# EAGLE board apex2_1 (EAGLE 5.09)
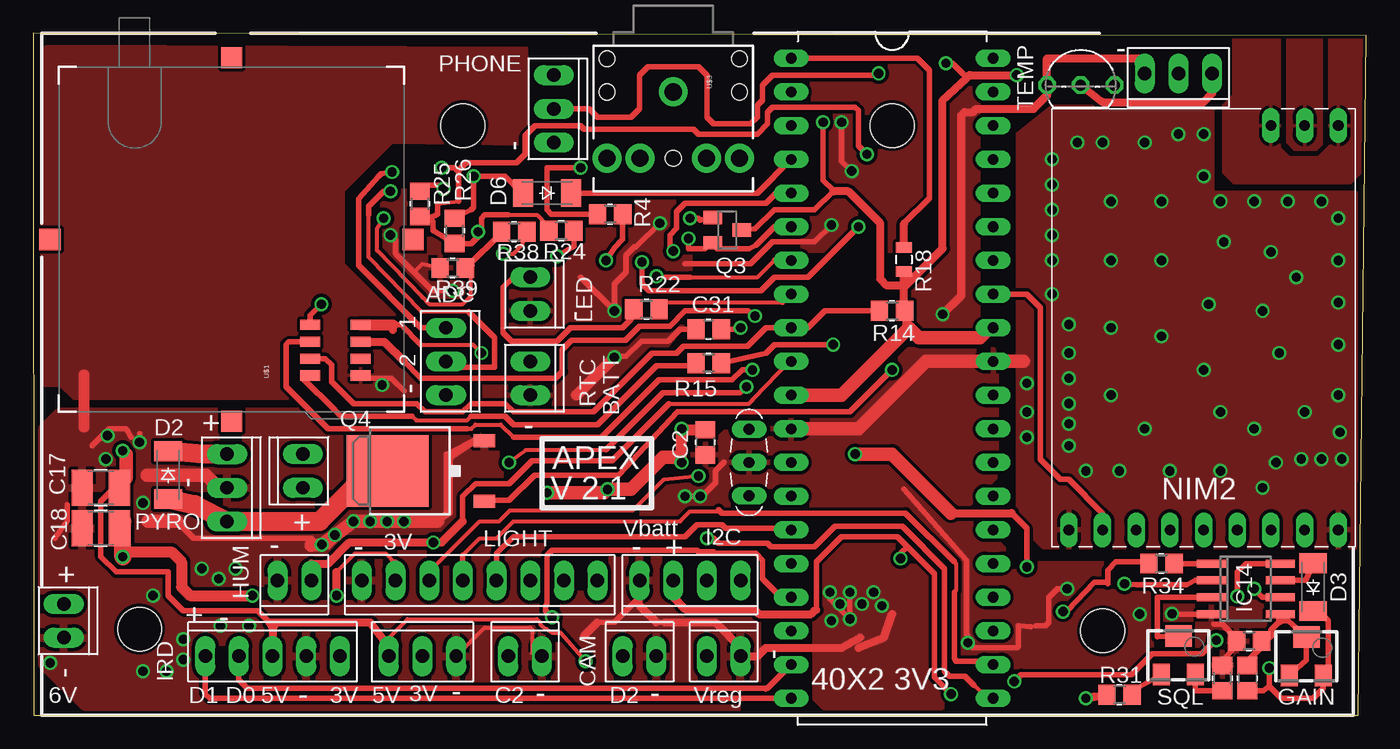
[diagram p1: board, top side]
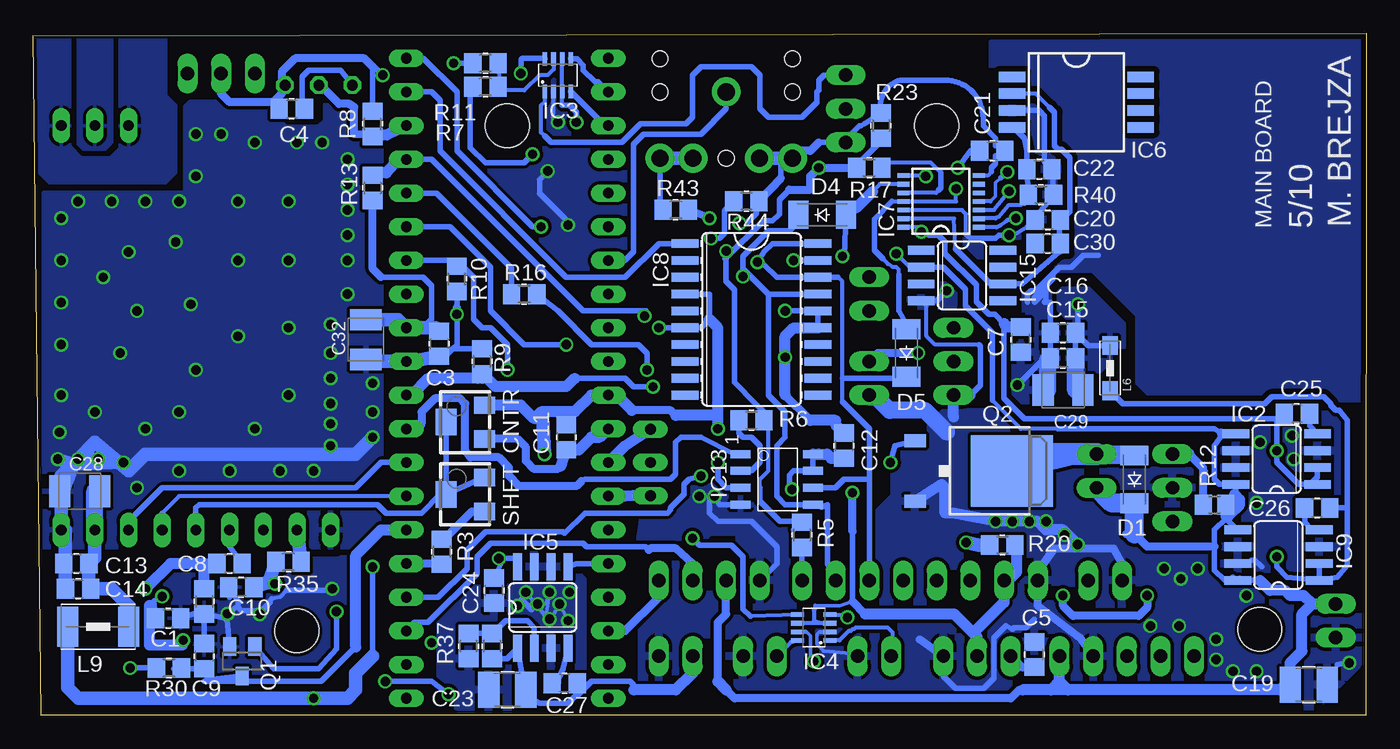
[diagram p2: board, bottom side, seen from below]

Size 100.57 x 51.45 mm. Coordinates in mm from the lower left corner, seen from the top.
Outline: 0.03,0.02 99.95,0 100.57,51.24 0,51.45 0.03,0.02
Copper layers (1*16): Top 0.035mm / dielectric 1.5mm / Bottom 0.035mm
Design rules "Fusion_eagle_rule_v1.1 *": minimum track width 6mil, minimum drill 12mil, track to track 10mil, track to pad 10mil, pad to pad 10mil, via to via 10mil, smd to smd 0mil, copper to edge 10mil, drill to drill 10mil, minimum pad ring 10mil, minimum via ring 6mil, stop-mask expansion 2mil, vias tented up to drill 100mil, thermal gap 10mil
Holes 3.3 mm at 32.41,44.47 64.8,44.47 80.67,6.37 8.03,6.5

## Footprints (pad centres in the part's own frame; a part is rotated, then mirrored left to right if it is on the bottom)
C0805 = smd 1.3 x 1.5: 1 -0.95,0; 2 0.95,0
C1210 = smd 1.6 x 2.7: 1 -1.4,0; 2 1.4,0
SMC_B = smd 1.6 x 2.4: + -1.5,0; - 1.5,0
SOD-123_MINI-SMA = smd 1.5 x 2.1: A 1.8,0; C -1.8,0
TO92- = drill 0.813 octagon: 1 -2.54,0; 2 0,0; 3 2.54,0
SO08 = smd 0.66 x 2.032: 1 -1.905,-3.073; 2 -0.635,-3.073; 3 0.635,-3.073; 4 1.905,-3.073; 5 1.905,3.073; 6 0.635,3.073; 7 -0.635,3.073; 8 -1.905,3.073
SOT23-8L = smd 0.35 x 1: 1 -0.975,-1.225; 2 -0.325,-1.225; 3 0.325,-1.225; 4 0.975,-1.225; 5 0.975,1.225; 6 0.325,1.225; 7 -0.325,1.225; 8 -0.975,1.225
SO8-7_5 = smd 0.8 x 2: 1 -1.905,-4.845; 2 -0.635,-4.845; 3 0.635,-4.845; 4 1.905,-4.845; 5 1.905,4.845; 6 0.635,4.845; 7 -0.635,4.845; 8 -1.905,4.845
TSSOP14 = smd 0.9 x 0.35: 1 -2.875,1.95; 2 -2.875,1.3; 3 -2.875,0.65; 4 -2.875,0; 5 -2.875,-0.65; 6 -2.875,-1.3; 7 -2.875,-1.95; 8 2.825,-1.95; 9 2.825,-1.3; 10 2.825,-0.65; 11 2.825,0; 12 2.825,0.65; 13 2.825,1.3; 14 2.825,1.95
SO20W = smd 0.66 x 2.032: 1 -5.715,-5.029; 2 -4.445,-5.029; 3 -3.175,-5.029; 4 -1.905,-5.029; 5 -0.635,-5.029; 6 0.635,-5.029; 7 1.905,-5.029; 8 3.175,-5.029; 9 4.445,-5.029; 10 5.715,-5.029; 11 5.715,5.029; 12 4.445,5.029; 13 3.175,5.029; 14 1.905,5.029; 15 0.635,5.029; 16 -0.635,5.029; 17 -1.905,5.029; 18 -3.175,5.029; 19 -4.445,5.029; 20 -5.715,5.029
SO8 = smd 0.61 x 1.524: 1 -1.27,-2.743; 2 0,-2.743; 3 1.27,-2.743; 4 2.54,-2.743; 5 2.54,2.743; 6 1.27,2.743; 7 0,2.743; 8 -1.27,2.743
SO08' = smd 0.6 x 2.2: 1 -1.905,-2.6; 2 -0.635,-2.6; 3 0.635,-2.6; 4 1.905,-2.6; 5 1.905,2.6; 6 0.635,2.6; 7 -0.635,2.6; 8 -1.905,2.6
10X08MTA = drill 1.016 long: 1 8.89,0; 2 6.35,0; 3 3.81,0; 4 1.27,0; 5 -1.27,0; 6 -3.81,0; 7 -6.35,0; 8 -8.89,0
10X05MTA = drill 1.016 long: 1 5.08,0; 2 2.54,0; 3 0,0; 4 -2.54,0; 5 -5.08,0
10X03MTA = drill 1.016 long: 1 2.54,0; 2 0,0; 3 -2.54,0
10X02MTA = drill 1.016 long: 1 1.27,0; 2 -1.27,0
10X04MTA = drill 1.016 long: 1 3.81,0; 2 1.27,0; 3 -1.27,0; 4 -3.81,0
1210 = smd 1.4 x 1.2: 1 -1.7,0; 2 1.7,0
1812 = smd 1.6 x 3: 1 -2.3,0; 2 2.3,0
DIL40 = drill 0.8 long: 1 -21.59,-8.89; 2 -19.05,-8.89; 3 -16.51,-8.89; 4 -13.97,-8.89; 5 -11.43,-8.89; 6 -8.89,-8.89; 7 -6.35,-8.89; 8 -3.81,-8.89; 9 -1.27,-8.89; 10 1.27,-8.89; 11 3.81,-8.89; 12 6.35,-8.89; 13 8.89,-8.89; 14 11.43,-8.89; 15 13.97,-8.89; 16 16.51,-8.89; 17 19.05,-8.89; 18 21.59,-8.89; 19 24.13,-8.89; 20 26.67,-8.89; 21 26.67,6.35; 22 24.13,6.35; 23 21.59,6.35; 24 19.05,6.35; 25 16.51,6.35; 26 13.97,6.35; 27 11.43,6.35; 28 8.89,6.35; 29 6.35,6.35; 30 3.81,6.35; 31 1.27,6.35; 32 -1.27,6.35; 33 -3.81,6.35; 34 -6.35,6.35; 35 -8.89,6.35; 36 -11.43,6.35; 37 -13.97,6.35; 38 -16.51,6.35; 39 -19.05,6.35; 40 -21.59,6.35
SOT23 = smd 1 x 1.4: 1 -0.95,-1.1; 2 0.95,-1.1; 3 0,1.1
DPACK_1 = smd 1 x 1.6: B -2.28,-4.8; E 2.28,-4.8 | smd 5.4 x 6.2: C 0,2.5
RTRIM3214W = smd 1.3 x 1.6: 1 -1.275,-1.45; 3 1.275,-1.45 | smd 2 x 1.6: 2 0,1.45
R0805 = smd 1.3 x 1.5: 1 -0.95,0; 2 0.95,0
R0805' = smd 1.3 x 1.5: 1 -0.85,0; 2 0.85,0
0805 = smd 0.8 x 1.2: 1 -0.9,0; 2 0.9,0
LASSEN_IQ_GPS = smd 0.762 x 1.524: 1 2.752,7.076; 2 2.752,3.266; 3 4.022,7.076; 4 4.022,3.266; 5 5.292,7.076; 6 5.292,3.266; 7 6.562,7.076; 8 6.562,3.266 | smd 1.6 x 1.6: GND1 -0.7,13; GND2 13,26.7; GND3 26.7,13; GND4 13,-0.7
CSTLS_G8 = drill 0.813 long: 1 -2.5,0; 2 0,0; 3 2.5,0
AUDIO-JACK = drill 1.3 pad 2.184 round: 1 0,0; 2 5,5; 3 5,2.5; 4 5,-2.5; 5 5,-5 | hole 1.2: 0,5; -2.5,5; -2.5,-5; 0,-5; 5,0
NIM2PK = drill 0.8 long: 1 -15.24,5.08; 2 -15.24,2.54; 3 -15.24,0; 10 15.24,-15.24; 11 15.24,-12.7; 12 15.24,-10.16; 13 15.24,-7.62; 14 15.24,-5.08; 15 15.24,-2.54; 16 15.24,0; 17 15.24,2.54; 18 15.24,5.08

## Placement (x,y rotation side)
C1  100n  [C0805]  90.39,7.32 180 bottom
C2  100n  [C0805]  50.7,20.6 90 top
C3  100n  [C0805]  69.94,28.03 90 bottom
C4  100n  [C0805]  81.05,45.74 180 bottom
C5  100n  [C0805]  25.05,4.59 270 bottom
C6  47n  [C0805]  91.59,2.82 270 top
C7  100n  [C0805]  26.06,28.34 90 bottom
C8  47n  [C0805]  85.75,11.45 0 bottom
C9  47n  [C0805]  87.66,4.47 270 bottom
C10  47n  [C0805]  84.86,9.67 0 bottom
C11  100n  [C0805]  60.35,20.98 90 bottom
C12  100n  [C0805]  39.4,20.34 270 bottom
C13  100n  [C0805]  97.31,11.45 0 bottom
C14  100p  [C0805]  97.18,9.55 0 bottom
C15  100n  [C0805]  22.89,26.95 0 bottom
C16  100p  [C0805]  22.89,28.85 0 bottom
C17  [C1210]  5.11,17.17 180 top
C18  22u  [C1210]  5.11,14.12 180 top
C19  [C1210]  4.35,2.31 0 bottom
C20  [C0805]  24.03,37.36 180 bottom
C21  [C0805]  28.22,42.57 0 bottom
C22  47p  [C0805]  24.67,41.17 0 bottom
C23  22u  [C1210]  64.8,1.93 180 bottom
C24  1u  [C0805]  65.81,9.42 90 bottom
C25  10n  [C0805]  5.23,22.75 0 bottom
C26  10n  [C0805]  3.71,15.64 180 bottom
C27  10n  [C0805]  60.48,2.43 180 bottom
C28  [SMC_B]  97.06,16.91 180 bottom
C29  [SMC_B]  22.89,24.53 180 bottom
C30  10n  [C0805]  24.03,35.58 0 bottom
C31  100n  [C0805]  50.95,29.1 0 top
C32  [SMC_B]  75.47,28.34 270 bottom
D1  CGRM4002-G  [SOD-123_MINI-SMA]  17.49,17.8 90 bottom
D2  CGRM4002-G  [SOD-123_MINI-SMA]  10.19,18.12 270 top
D3  CGRM4002-G  [SOD-123_MINI-SMA]  96.55,9.67 90 top
D4  CGRM4002-G  [SOD-123_MINI-SMA]  41.05,37.74 0 bottom
D5  CGRM4002-G  [SOD-123_MINI-SMA]  34.7,27.33 90 bottom
D6  CGRM4002-G  [SOD-123_MINI-SMA]  38.76,39.39 180 top
IC1  DS18B20  [TO92-]  79.02,47.52 0 top
IC2  LT1763  [SO08]  6.76,19.33 90 bottom
IC3  MAX3373E  [SOT23-8L]  60.99,48.28 0 bottom
IC4  MAX3373E  [SOT23-8L]  41.68,6.63 90 bottom
IC5  LT1763  [SO08]  62.13,8.15 0 bottom
IC6  MPX6115  [SO8-7_5]  21.87,46.25 270 bottom
IC7  MCP3204  [TSSOP14]  32.09,38.76 180 bottom
IC8  DS3234  [SO20W]  46.38,29.87 270 bottom
IC9  LT1763  [SO08]  6.63,12.09 90 bottom
IC13  FM25-S  [SO8]  44.48,18.44 270 bottom
IC14  CA3240ED  [SO08']  91.47,9.55 270 top
IC15  MAX6133  [SO08]  30.51,33.17 270 bottom
J1  [10X08MTA]  33.68,10.18 180 top
J2  [10X05MTA]  18.06,4.47 0 top
J3  [10X03MTA]  86.39,48.41 180 top
J4  [10X03MTA]  14.63,17.17 270 top
J5  [10X02MTA]  20.35,18.44 90 top
J6  [10X02MTA]  37.49,25.42 270 top
J7  [10X03MTA]  39.27,45.74 270 top
J8  [10X02MTA]  45.75,4.47 0 top
J9  [10X02MTA]  37.11,4.47 0 top
J10  [10X02MTA]  37.49,31.77 270 top
J11  [10X02MTA]  52.1,4.47 0 top
J12  [10X02MTA]  19.71,10.18 180 top
J13  [10X02MTA]  2.31,7.13 270 top
J14  [10X03MTA]  29.36,4.47 0 top
J15  [10X04MTA]  49.56,10.18 180 top
J18  [10X03MTA]  31.14,26.69 270 top
L6  [1210]  19.33,26.18 90 bottom
L9  [1812]  95.66,6.69 180 bottom
PIC1  PICAXE40X2  [DIL40]  66.07,27.96 270 top
Q1  BCX70SMD  [SOT23]  84.8,4.09 180 bottom
Q2  IRF740DPACK  [DPACK_1]  29.24,18.44 270 bottom
Q3  BCX70SMD  [SOT23]  52.35,36.6 270 top
Q4  IRF740DPACK  [DPACK_1]  29.24,18.44 90 top
R1  100K  [RTRIM3214W]  67.97,22.12 90 bottom
R2  100K  [RTRIM3214W]  67.97,16.66 90 bottom
R3  10K  [R0805]  69.75,12.34 270 bottom
R4  100  [R0805]  43.52,37.8 0 top
R5  100  [R0805]  42.57,13.61 270 bottom
R6  100  [R0805]  46.38,22.25 0 bottom
R7  0  [R0805]  66.45,47.39 180 bottom
R8  4k7  [R0805]  74.96,44.6 90 bottom
R9  100k  [R0805]  66.7,26.69 270 bottom
R10  100k  [R0805]  68.61,32.91 90 bottom
R11  0  [R0805]  66.45,49.17 180 bottom
R12  1k  [R0805']  11.46,15.9 0 bottom
R13  100k  [R0805]  74.96,39.77 270 bottom
R14  100k  [R0805]  64.8,30.5 0 top
R15  1k  [R0805]  50.95,26.56 180 top
R16  1k  [R0805]  63.53,31.77 0 bottom
R17  51k  [R0805]  37.49,41.3 0 bottom
R18  10K  [0805]  65.69,34.38 270 top
R20  22K  [R0805]  27.46,12.85 0 bottom
R22  1k  [R0805]  46.26,30.63 0 top
R23  33k  [R0805]  36.6,44.47 270 bottom
R24  10k  [R0805]  39.84,36.53 180 top
R25  10k  [R0805]  29.17,38.57 270 top
R26  10k  [R0805]  31.78,36.53 270 top
R27  100K  [RTRIM3214W]  96.04,4.47 0 top
R28  1K5  [R0805]  87.66,8.59 270 bottom
R29  1K  [R0805]  91.72,5.61 180 top
R30  10K  [R0805]  90.32,3.58 180 bottom
R31  10K  [R0805]  81.94,1.55 180 top
R32  10K  [R0805]  89.69,2.82 270 top
R33  100K  [RTRIM3214W]  86.39,4.53 0 top
R34  4K7  [R0805]  85.12,11.45 0 top
R35  10K  [R0805]  81.31,11.58 180 bottom
R36  22K  [R0805]  65.94,5.23 270 bottom
R37  22K  [R0805]  67.72,5.23 90 bottom
R38  4K7  [R0805]  36.29,36.47 0 top
R39  4K7  [R0805]  31.65,33.74 0 top
R40  51K  [R0805]  24.54,39.27 0 bottom
R43  10K  [R0805]  52.1,38.12 180 bottom
R44  10K  [R0805]  46.76,38.76 180 bottom
U$1  LASSEN_IQ_GPSLASSEN  [LASSEN_IQ_GPS]  27.97,22.88 90 top
U$2  RESONATOR_4M  [CSTLS_G8]  54,19.07 270 top
U$3  AUDIO-JACK2  [AUDIO-JACK]  48.29,47.01 270 top
X1  NIM2  [NIM2PK]  93.37,29.23 270 top

## Tracks (layer width: path | path; a pad name or v marks a point on that pad's centre or on a via)
1WIRE
  Top 0.61: J3.3 88.93,46.88 88.29,46.25 80.67,46.25 IC1.2
  Bottom 0.61: IC1.2 78.89,47.52 77.5,46.12 76.74,46.12 76.35,45.87 76.35,43.84 75.27,43.78 R8.1
  Bottom 0.813: R8.1 73.88,43.78 PIC1.38
+3V3  (via drill 0.7)
  Top 0.305: 22.89,10.82 24.28,12.21 26.57,12.21 27.33,11.45
  Top 0.406: Q3.3 54.47,36.68 55.91,38.12 58.96,38.12 60.35,39.52 60.35,39.58 59.59,40.34 v59.59,44.73 | R14.2 65.75,29.55 66.07,29.23 | 69.5,15.26 69.62,15.13 | v68.86,49.17 69.35,49.17 70.43,48.09 | v74.96,11.2 74.96,14.12 73.81,15.26 | C31.2 53.24,29.1 v53.37,29.23
  Top 0.61: v22.89,9.04 22.89,10.82 | 27.33,11.45 J1.2 | R31.2 80.04,1.42 v79.4,1.29 | v74.2,48.28 70.64,48.28 70.43,48.09 68.61,46.38 68.61,35.2 65.69,32.28 | 69.24,15.26 69.5,15.26 73.81,15.26 | v6.76,11.96 7.14,12.34 | 65.69,32.28 65.69,30.56 R14.2 | 65.69,32.28 65.69,32.41 | 65.69,32.41 R18.2 | 60.35,39.52 61.5,39.52 63.91,37.11 63.91,32.91 64.42,32.41 65.69,32.41
  Top 0.813: v48.92,19.07 v48.92,21.61 48.99,21.55 C2.2 | v16.54,9.04 11.84,9.04 11.2,9.67 11.2,11.58 10.44,12.34 7.14,12.34
  Top 1.016: PIC1.11 60.99,24.15 66.07,29.23 66.83,28.47 71.4,28.47 72.16,29.23 PIC1.32 | v62,19.71 64.8,19.71 69.24,15.26 | v38.76,16.79 43.08,16.79 v43.33,17.04 45.11,17.04 47.53,19.45 48.54,19.45 v48.92,19.07
  Top 1.27: C18.1 6.76,14.63 v6.76,11.96
  Bottom 0.254: 41.56,8.28 39.72,8.28 38.76,8.59
  Bottom 0.305: 38.76,13.87 38.64,13.99 | 60.66,46 IC3.3 IC3.6 | 40.99,6.95 IC4.6 | 40.99,6.95 IC4.3 | 40.99,6.95 41.68,7.13 41.68,7.9 41.56,8.28
  Bottom 0.406: 74.32,33.04 71.15,33.04 70.51,32.41 70.51,29.87 71.15,29.23 PIC1.32 | 1.42,15.64 1.42,11.33 2.19,10.44 IC9.1 | 1.42,15.64 1.42,22.25 2.06,23.01 2.31,23.01 2.69,23.39 2.69,23.52 3.2,24.02 7.14,24.02 7.65,23.52 18.36,23.52 L6.1 | IC13.3 48.29,17.17 48.92,17.8 v48.92,19.07 | IC13.8 IC13.7 43.21,18.44 43.53,18.12 43.53,17.29 v43.33,17.04 | IC8.4 49.56,31.77 49.56,29.87 50.19,29.23 IC8.6 v53.37,29.23 | 38.76,8.59 38.76,13.87 | 41.3,19.71 41.94,19.71 | C4.2 82,46.82 81.82,47.01 | v6.76,11.96 6.76,11.2 6,10.44 IC9.1 | 1.42,15.64 C26.1 | IC9.1 IC9.2 | v59.59,44.73 59.59,45.49 60.1,46 60.66,46 | v68.86,49.17 R11.2 | v74.96,11.2 74.96,4.47 | R8.2 74.96,48.92 74.83,48.92 v74.2,48.28
  Bottom 0.61: R13.2 74.96,33.68 74.32,33.04 | J1.2 27.33,9.86 | 26.38,12.08 R20.2 | 29.36,6.5 J14.2 | v16.54,9.04 16.54,8.15 17.17,7.52 22.13,7.52 22.89,8.28 v22.89,9.04 | 37.81,7.64 38.76,8.59 | 55.4,23.01 52.48,23.01 52.1,22.63 | 38.76,13.87 v38.76,16.79 | J3.2 86.39,46.88 85.75,46.25 82.45,46.25 81.82,46.88 81.82,47.01 81.82,47.39 | 81.82,47.39 IC1.3 | 81.82,47.39 81.82,48.54 80.8,49.55 75.59,49.55 74.96,48.92
  Bottom 0.813: 27.33,9.86 26.38,10.82 26.38,12.08 | 29.36,6.5 27.33,8.53 J1.2 | 49.56,29.87 48.92,29.23 48.92,22.63 | J14.2 29.36,5.93 31.08,7.64 37.81,7.64 | 55.4,23.01 56.54,24.15 PIC1.11 58.45,24.15 59.72,22.88 60.99,22.88 | 48.92,22.63 52.1,22.63 | v48.92,21.61 48.92,22.63 | 60.99,22.88 62.26,22.88 62.77,22.37 | 62.77,22.37 62.13,22.5 | C11.2 60.35,22.25 60.99,22.88 | C12.2 40.35,19.39 40.67,19.71 41.3,19.71 IC13.8 | R1.3 63.79,23.39 62.77,22.37
  Bottom 1.016: C3.2 70.2,29.23 PIC1.32 73.03,29.84 C32.+ | L9.2 97.96,2.07 97.18,1.29 v79.4,1.29 76.86,1.29 76.23,1.93 76.23,3.2 74.96,4.47 | 62.13,22.5 v62,19.71
+5V  (via drill 0.7)
  Top 0.305: R24.2 38.76,36.98 38,37.74 35.84,37.74 | 30.51,38.57 32.1,38.76 | v41.68,4.09 39.78,6.25 39.14,6.25 38.76,6.5 38.64,6.5 38.25,6.88 38.25,7.01 38,7.26 28.25,7.26 26.56,5.57
  Top 0.406: 6.38,17.42 5.11,16.15 5.11,11.96 6.25,10.82 10.19,10.82 10.19,9.04 11.33,7.9 16.92,7.9 17.81,7.01 | 29.87,37.49 30.19,37.17 30.19,36.54 30.19,36.53 R26.2 33.05,35.58 33.56,36.09 v33.56,36.47 33.81,36.73 33.81,37.49 34.06,37.74 35.84,37.74 | 29.87,37.49 28.92,37.49 R25.2 | 32.1,38.76 32.1,40.98 31.9,41.17 | 30.51,38.57 30.51,37.8 29.87,37.49 | v30.82,41.3 31.78,41.3 31.9,41.17 | 31.9,41.17 32.16,41.17 32.67,41.68 36.48,41.68 37.11,42.31 37.11,43.71 37.87,44.47 41.3,44.47 41.56,44.22 49.81,44.22 50.19,43.84 54.64,43.84 55.4,44.6 55.4,45.49 55.78,45.87 62,45.87 62.26,45.62 62.26,42.95 v62.89,42.31
  Top 0.61: 18.06,6.63 18.44,7.01 | 18.06,6.63 J2.3 | 18.06,6.63 17.81,7.01 18.44,7.01 | J14.3 26.82,5.23 26.56,5.57 25.43,7.01 18.44,7.01
  Top 1.016: v6.76,19.96 7.01,19.71 7.01,17.93 C17.1 6.38,17.42
  Bottom 0.254: 42.25,6.3 41.94,5.99 41.94,4.34 v41.68,4.09
  Bottom 0.305: IC7.14 33.57,36.81 v33.56,36.47 | 42.25,6.3 IC4.7
  Bottom 0.406: 6.76,22.37 v6.76,19.96 6.76,19.07 5.11,17.42 4.22,17.42 | 6.76,22.37 6.5,22.37 6.18,22.69 C25.1 | 6.76,22.37 25.81,22.37 27.33,23.9 27.33,29.55 28.03,30.25 28.48,30.25 29.43,31.2 29.43,32.47 31.78,34.82 31.78,35.71 32.29,36.22 32.99,36.22 v33.56,36.47 33.49,36.22 | C21.1 29.87,42.57 v30.82,41.3 | 4.22,17.42 IC2.1 | IC2.2 3.69,17.95 4.22,17.42 | v62.89,42.31 63.53,41.68 66.45,41.68 67.59,42.82 67.59,47.07 R7.2
  Bottom 0.61: C5.2 26,3.64 J14.3
  Bottom 0.813: C7.2 27.08,29.29 27.33,29.55
+12V  (via drill 0.7)
  Top 0.305: R38.2 36.92,35.52 36.22,34.82 v35.46,34.82
  Top 0.406: IC14.8 91.47,11.45 90.83,10.82 v90.83,8.98 | v89.25,5.67 88.93,5.42 88.17,4.66 84.42,4.66 82.83,3.07 74.51,3.07 v74.01,2.56 | 59.08,7.96 59.08,11.58 60.99,13.48 65.18,13.48 65.94,12.72 | 65.94,12.72 67.97,10.69 67.97,2.88 v69.24,1.61 | v65.43,11.83 65.43,12.21 65.94,12.72
  Top 0.61: J15.2 48.29,8.91 49.18,8.02 54.38,8.02 54.76,7.64 58.7,7.64 59.02,7.96 59.08,7.96
  Bottom 0.305: 28.22,23.77 26.06,21.61 23.27,21.61 | v35.46,34.82 34.44,33.8 IC15.2
  Bottom 0.406: 9.55,10.18 9.55,10.33 | 23.27,21.61 11.46,21.61 10.97,21.32 10.82,21.23 11.46,20.34 11.46,17.8 11.08,17.42 IC2.8 9.83,16.67 R12.2 10.61,14.84 | 28.22,23.77 28.22,28.85 30.25,30.88 30.25,32.15 31.9,33.8 IC15.2 | 91.78,8.28 91.47,8.59 | 91.47,8.59 v90.83,8.98 | v74.01,2.56 70.51,2.56 v69.24,1.61 | C1.2 91.47,8.59 | IC2.5 10.98,21.23 10.98,21.01 | 10.61,14.84 11.46,13.99 11.46,12.72 11.46,10.94 10.7,10.18 10.31,10.18 10.06,10.44 IC9.8 8.03,10.18 | IC9.5 10.01,14.25 10.61,14.84 | 25.94,1.93 26.19,1.93 | IC5.8 64.01,11.83 v65.43,11.83 65.18,11.58 C24.2
  Bottom 0.61: 48.92,2.56 48.92,7.01 48.29,7.64 J15.2 | 10.31,10.18 IC9.8 9.55,10.18 | R12.2 9.55,15.9 9.45,15.9 | 18.13,13.67 17.49,13.67 16.54,12.72 11.46,12.72 | 10.98,21.23 10.98,21.32 10.97,21.32 | 26.19,1.93 26.82,1.29 47.65,1.29 48.29,1.93
  Bottom 0.813: 23.14,2.56 23.78,1.93 | 23.14,2.56 J2.1 | 22.51,1.93 23.14,2.56 | 48.29,1.93 48.92,2.56 | 91.78,8.28 91.78,5.29 89.31,5.29 v89.25,5.67 | 23.78,1.93 25.94,1.93 | 22.51,1.93 23.78,1.93 | 4.09,8.4 J13.2 | 4.09,8.4 4.73,9.04 5.74,9.04 6.12,9.42 7.27,9.42 8.03,10.18 | 4.09,8.4 4.85,7.64 4.85,4.85 5.75,3.96 C19.1 6.12,2.31 6.5,1.93 22.51,1.93 | 9.55,15.9 9.55,16.28 9.93,16.66 9.93,15.64 10.57,15.01 10.44,15.01 9.55,15.9
  Bottom 1.422: 17.49,13.67 D1.C 19.18,16 J5.2
ADCCS
  Top 0.406: PIC1.4 54.64,39.39 D6.C
AUX1
  Bottom 0.61: PIC1.18 55.91,6.37 53.37,8.91 J15.4
AUX2
  Bottom 0.406: PIC1.23 71.78,7.01 70.77,7.01 67.08,10.69 67.08,11.96 66.07,12.98 59.08,12.98 58.83,12.72 54.38,12.72 54.13,12.47
  Bottom 0.61: 54.13,12.47 54,12.6 52.1,12.6 50.83,11.45 J15.3
CHDK1  (via drill 0.7)
  Top 0.305: 70.97,2.26 72.1,1.29
  Top 0.406: 70.97,2.26 70.29,2.94 69.12,2.94 68.73,3.32 68.73,11.07 65.56,14.25 60.48,14.25 58.96,12.72 55.65,12.72 55.4,12.98 51.72,12.98 51.34,13.36 v50.83,13.36
  Top 0.61: 72.1,1.29 PIC1.21
  Bottom 0.305: IC4.5 46.47,7.47
  Bottom 0.406: 46.47,7.47 47.02,8.02 47.02,11.96 47.91,12.85 50.32,12.85 v50.83,13.36
CHDK2  (via drill 0.7)
  Top 0.406: v39.14,7.39 38.64,7.9 38.64,8.28 38.76,8.4 38.76,12.09 39.14,12.47 50.07,12.47 50.19,12.34 51.34,12.34 51.46,12.21 54.51,12.21 55.02,11.71 55.02,10.31 56.16,9.17 56.92,9.17 PIC1.17
  Bottom 0.305: IC4.4 39.36,7.6 v39.14,7.39
  Bottom 0.406: v39.14,7.39 39.4,7.64
CLK  (via drill 0.7)
  Top 0.406: v62.26,36.85 58.45,33.04 55.91,33.04 54.89,32.03 46.45,32.03 45.94,32.53 v45.94,34.18
  Bottom 0.305: 39.52,23.64 39.52,25.42 39.52,32.73 39.84,33.04
  Bottom 0.406: IC8.18 40.03,33.04 | 39.84,33.04 IC8.18 | v62.26,36.85 62.89,36.85 68.61,42.57 68.61,47.01 71.15,49.55 PIC1.40 | IC8.18 44.48,33.04 45.43,33.99 v45.94,34.18 45.43,34.95 44.79,35.58 IC8.20 | J1.6 37.49,17.8 | 37.49,17.8 37.49,21.61 39.52,23.64 | 39.52,25.42 34.44,25.42 D5.C | IC13.6 40.03,17.17 39.4,17.8 37.49,17.8
DDV  (via drill 0.7)
  Top 0.406: D6.A 36.86,39.39 35.59,40.66 v33.24,40.66 33.24,38.31 33.05,38.12 R26.1
  Bottom 0.305: IC7.8 33.73,40.71 v33.24,40.66
GND  (via drill 0.7)
  Top 0.305: R39.1 29.36,34.06 28.73,33.42 | J9.1 37.87,4.47 37.62,4.72 37.62,6.5 37.49,6.63 34.06,6.63 J14.1
  Top 0.406: 90.83,5.74 91.15,6.05 R29.2 90.83,6.06 90.83,5.36 89.69,4.09 R32.1 | PIC1.12 56.54,21.61 | Q4.E 33.42,20.72 31.46,19.39 31.46,15.26 30.51,14.63 31.14,15.26 31.14,19.71 33.68,20.98 | 75.27,6.69 74.32,6.75 74.32,5.23 74.2,5.1 70.89,5.1 v70.51,5.48 70.51,5.99 70.39,6.12 70.39,11.71 65.69,17.04 | v8.03,20.6 8.03,21.23 | 42.57,7.01 43.84,7.01 45.75,8.91 J15.1 45.75,8.28 | 47.02,7.01 47.65,7.01 48.29,7.01 | 1.61,13.36 2.57,14.63 2.57,15.9 | 4.47,20.34 5.74,21.61 7.01,21.61 7.39,20.98 | v49.18,16.53 v50.32,16.53 50.45,16.53 51.46,17.55 51.46,18.44 52.1,19.07 | 27.97,24.47 27.02,25.42 26.06,25.42 | 26.06,25.42 24.91,25.42 U$1.2 | 10.82,14.63 12.09,13.36 20.98,13.36 21.62,12.72 22.25,12.72 v24.16,14.63 v27.97,14.63 | v31.65,32.03 30.13,32.03 28.73,33.42 27.33,34.82 27.33,35.84 v26.95,36.22 | 41.3,33.04 v43.84,30.5 43.84,32.53 44.73,33.42 44.73,34.69 45.37,35.33 45.49,35.33 v47.27,37.11 | v26.32,24.91 26.32,25.17 26.06,25.42 | IC14.4 86.07,7.64 v85.91,7.67 | v78.01,9.55 77.24,9.55 76.61,8.91 76.61,7.01 76.35,6.75 75.65,6.75 | 89.05,6.88 89.69,6.88 90.71,5.86 | v60.99,44.73 60.99,41.8 v61.75,41.04 | 49.18,34.06 54.13,34.06 55.78,35.71 58.96,35.71 v60.23,36.98 | v60.1,9.29 60.1,8.79 v61.62,7.26 v61.62,9.29 | C31.1 48.8,29.1 47.91,28.22 45.87,28.22 44.73,27.07 43.91,27.07 v43.84,27.01
  Top 0.61: 62.26,5.1 64.16,5.86 64.8,7.64 | 42.57,7.01 41.56,5.99 | 45.75,8.28 47.02,7.01 | 62.38,5.86 60.99,5.1 55.27,5.1 54.64,4.47 J11.1 53.37,5.1 51.46,7.01 47.65,7.01 | J1.1 24.79,8.91 | J3.1 83.85,49.42 83.72,49.55 76.48,49.55 IC1.1 76.48,46.76 75.47,45.74 71.15,45.74 70.89,45.49 70.26,45.49 70,45.23 70,31.64 v68.61,30.25
  Top 0.813: 3.84,21.74 3.84,25.68 | v43.84,27.01 40.99,24.15
  Top 1.016: PIC1.12 62.26,21.61 67.34,26.69 PIC1.31 74.7,26.69 | 30.51,14.63 v27.97,14.63 v26.7,14.63 v25.43,14.63 v24.16,14.63 22.89,13.67 v21.78,12.88 20.98,12.85 | 8.66,14.63 10.82,14.63 | J4.2 14,17.17 13.05,18.12 8.6,18.12
  Bottom 0.254: 41.25,6.3 41.43,6.12 41.43,5.36 40.92,4.85 | v60.23,7.13 v60.86,8.4 61.62,7.01 v63.4,9.29 61.88,7.52 v61.62,9.29 61.88,8.4 v62.51,8.4 v64.04,8.28
  Bottom 0.305: IC7.12 30.49,38.11 30.19,37.8 30.19,36.28 | IC6.3 24.79,45.62 24.54,45.36 | 24.67,37.11 24.54,37.23 | 25.55,36.85 26.82,36.09 v26.95,36.22 | 29.24,27.96 32.54,27.96 33.17,28.6 33.17,30.86 IC15.4 | 82.58,8.79 81.94,8.91 81.43,9.42 | IC7.7 28.56,40.71 28.29,40.98 | 61.31,45.05 IC3.2 | 41.25,6.3 IC4.2 | 40.92,4.85 38.51,4.59 J9.1
  Bottom 0.406: 85.75,8.91 C10.1 85.12,8.6 85.12,8.28 | 86.07,7.33 86.37,7.39 | 86.37,7.39 R28.2 87.66,7.01 | v85.91,7.67 86.07,7.33 | 85.12,8.28 v85.91,7.67 | IC8.15 IC8.16 v43.84,30.5 | v68.61,30.25 68.61,27.96 68.93,27.64 | 68.61,30.76 R10.1 | 68.93,27.64 69.88,26.69 71.98,26.69 | R9.1 68.93,27.64 | IC13.4 48.8,15.9 v49.18,16.53 49.56,16.53 49.56,15.26 48.92,14.63 46.38,14.63 44.48,12.72 44.48,11.45 J15.1 45.75,9.55 | IC15.4 32.41,31.26 v31.65,32.03 | v26.95,36.22 27.71,36.22 27.97,35.96 29.87,35.96 30.19,36.28 | 25.55,36.85 24.67,37.11 24.92,37.36 C20.2 | Q1.2 85.92,7.18 86.07,7.33 | 87.66,7.01 C9.1 | 29.87,24.15 29.11,24.91 29.11,27.83 29.24,27.96 | 24.09,27.14 v26.32,24.91 | 24.09,27.14 23.84,27.39 C16.1 23.84,31.14 24.28,31.14 24.16,31.26 24.16,32.41 | C15.1 23.9,26.95 24.09,27.14 | v85.91,7.67 86.28,7.48 86.37,7.39 | C1.1 88.36,7.71 87.66,7.01 | 85.12,8.28 85.12,8.15 84.86,7.9 83.34,7.9 82.7,8.53 82.7,8.66 82.58,8.79 | 81.43,9.42 77.88,9.42 77.75,9.55 v78.01,9.55 | 1.17,4.09 2.19,3.83 | 24.54,37.23 24.54,38.06 R40.2 C22.2 24.28,41.74 24.28,45.23 24.67,45.62 IC6.3 | v47.27,37.11 46.76,37.11 46,37.87 46,38.5 45.81,38.69 | 45.81,38.69 45.75,38.76 45.75,38.88 44.99,39.65 | R44.1 45.81,38.69 | IC1.1 77.37,48.66 79.78,48.66 80.29,48.16 80.29,46.38 80.16,45.74 C4.1 | 8.66,11.71 8.41,11.71 7.9,11.2 | 31.14,22.5 31.27,22.37 | 28.29,40.98 28.29,41.3 27.97,41.62 27.97,42.19 C21.2 27.97,42.95 27.97,43.52 28.9,44.45 28.9,45.03 arc-90 31.78,47.9 35.14,47.9 arc-90 R23.1 37.68,44.73 37.87,44.6 38.13,44.47 38.25,44.47 39.52,43.2 | 3.58,19.96 IC2.3 3.96,19.96 | 39.52,43.2 41.3,43.2 | 39.52,43.2 J7.1 | v60.99,44.73 61.31,45.05
  Bottom 0.406: v60.23,36.98 60.23,37.23 62.38,39.39 62.38,40.41 v61.75,41.04 | J14.1 31.9,2.94 31.02,2.05 28.86,2.05 28.09,2.82 28.09,5.86 27.21,6.75 26.7,6.5 26.57,6.63 25.68,6.63 25.05,7.26 | 62.96,7.96 63.65,8.66 v64.04,8.28 63.4,9.32 | 44.18,40.52 44.18,42.01 U$3.5 42.73,42.01 42.73,42.57 | 20.22,34.69 21.36,34.69 22.25,33.8 23.14,33.8 23.65,33.3 | 23.65,33.3 23.65,32.91 24.16,32.41 | 25.55,31.14 25.55,31.77 25.3,32.03 24.92,32.03 23.65,33.3 | 24.28,31.9 25.05,31.14 25.05,31.52 24.41,32.15 24.41,32.41 24.16,32.41
  Bottom 0.61: 41.3,43.2 41.94,42.57 42.73,42.57 | 44.18,40.52 R44.1 | J12.1 18.44,11.45 19.08,12.6 23.52,12.6 24.79,10.82 J1.1 24.79,8.28 21.62,5.86 J2.2 | J14.1 33.68,5.74 | 41.94,22.25 43.84,24.15 | v68.61,30.25 68.61,30.76 | R1.1 64.03,20.84 63.4,20.21 63.4,19.2 62.77,18.56 61.02,18.56 60.75,18.82
  Bottom 0.813: Q2.E 32.04,17.43 31.78,17.17 31.78,15.26 31.14,15.26 v27.97,14.63 v26.7,14.63 v25.43,14.63 24.79,14.63 24.16,13.99 22.89,13.99 v21.78,12.88 | PIC1.12 57.81,20.98 58.45,20.98 59.4,20.03 C11.1 60.75,18.82 | IC8.15 43.21,29.23 43.84,28.6 v43.84,27.01 43.84,24.15 | 41.94,22.25 40.03,22.25 40.03,21.93 C12.1 | 29.87,24.15 J18.1 31.14,22.5
  Bottom 1.016: X1.18 98.13,13.99 98.13,11.58 C13.1 98.13,11.33 C14.1 | C3.1 71.98,26.69 PIC1.31 74.83,26.69 | v97.18,19.33 97.56,18.94 | 97.56,18.94 v98.71,19.33 | v97.18,19.33 v95.66,19.33 v93.75,19.07 97.56,18.94 | 97.56,18.94 98.45,16.53 X1.18 | X1.18 98.45,18.06 97.56,18.94 | v97.18,19.33 95.91,20.6 93.37,18.44 92.1,19.71 76.23,19.71 v74.96,20.98 | U$3.5 U$3.4
  Bottom 1.27: 24.03,24.53 24.03,26.82 23.9,26.82 | 23.9,26.82 23.9,26.95 | 23.9,26.82 23.9,26.69 | 37.37,24.02 36.98,24.02 35.97,23.01 33.3,23.01 31.65,21.36 | 37.37,24.02 37.49,24.02 | J6.1 37.37,24.15 37.37,24.02
  other vias: 74.96,22.88 74.96,25.04 98.58,21.36 98.45,24.15 98.45,27.96 98.45,31.14 98.45,34.31 98.45,37.49 97.18,38.76 94.64,38.76 92.1,38.76 89.56,38.76 88.29,40.66 88.29,43.84 86.39,43.84 83.85,43.2 80.67,43.2 78.77,43.2 76.86,41.93 76.86,40.03 76.86,38.12 76.86,36.22 76.86,34.31 92.74,17.17 92.1,21.61 95.91,22.88 94.01,27.33 92.74,30.5 95.28,33.04 93.37,34.95 85.12,38.76 81.31,38.76 85.12,34.31 81.31,34.31 76.86,31.77 81.31,29.23 85.12,28.6 88.29,26.06 89.56,22.88 89.56,18.44 85.75,18.44 83.85,21.61 81.94,18.44 79.4,18.44 78.13,20.34 78.13,23.52 78.13,27.33 81.31,24.15 8.28,3.32 8.28,16.02 11.33,5.74 11.33,4.21 9.04,9.04 14,10.31 1.3,3.96 89.82,35.71 88.67,31.01 78.13,29.49 78.13,25.42 78.13,21.99 5.62,21.1 5.49,19.33 10.06,3.32 22.76,13.61 83.47,7.64 15.27,11.07 12.73,11.07 16.28,6.75 14.12,6.75
  pour Top: 68.61,10.94 68.73,0.91 68.48,0.66 59.72,0.66 59.08,1.29 59.08,12.85 60.1,13.87 65.81,13.87
  pour Bottom (isolate 0.254): 76.61,43.58 88.8,43.96 88.93,39.39 99.72,39.39 99.72,12.72 76.23,12.72 74.32,14.63 74.32,43.84 75.08,43.58
  pour Top (isolate 0.254): 76.99,45.87 88.93,45.87 88.93,39.39 99.72,39.39 99.72,12.72 76.23,12.72 74.32,14.63 74.32,43.84 76.74,45.74 76.86,45.74
  pour Bottom (isolate 0.254): 60.35,11.45 61.62,11.45 62.26,12.09 66.7,12.09 68.61,10.18 68.61,8.28 69.88,7.01 69.88,1.93 68.61,0.66 59.08,0.66 59.08,10.18
  pour Top (isolate 0.254): 1.93,22.88 0.66,21.61 0.66,3.83 3.84,0.66 53.37,0.66 54.64,1.93 54.64,12.09 53.37,13.36 38.76,13.36 35.59,16.53 35.59,19.07 32.41,22.25 31.78,22.88
  pour Bottom (isolate 0.254): 1.93,22.88 0.66,21.61 0.66,3.83 3.84,0.66 53.37,0.66 54.64,1.93 54.64,12.09 53.37,13.36 38.76,13.36 35.59,16.53 35.59,19.07 32.41,22.25 31.78,22.88
  pour Top (isolate 0.254): 1.04,50.44 37.24,50.31 37.24,43.07 27.08,43.2 23.4,39.52 23.4,34.06 28.98,28.47 28.98,22.25 28.35,21.61 22.63,21.61 20.35,23.9 3.08,23.9 2.06,24.91 0.92,24.91 0.66,25.17 0.66,50.06
  pour Top (isolate 0.254): 33.17,32.66 32.92,35.33 32.67,35.58 31.14,35.58 30,36.73 28.98,36.73 28.48,37.23 28.48,39.39 28.35,39.52 26.95,39.52 25.17,37.74 25.17,35.07 29.62,30.63 31.65,30.63 33.05,31.14 33.05,32.41
  pour Bottom (isolate 0.254): 23.9,31.9 23.9,29.99 23.27,29.36 23.27,25.68 24.92,24.02 26.19,24.02 26.57,24.41 26.57,29.36 25.43,30.5 25.3,30.5
  pour Bottom (isolate 0.254): 1.93,22.88 0.66,21.61 0.66,3.83 3.84,0.66 53.37,0.66 54.64,1.93 54.64,12.09 53.37,13.36 38.76,13.36 35.59,16.53 35.59,19.07 32.41,22.25 31.78,22.88
  pour Bottom (isolate 0.254): 89.05,39.52 89.05,45.87 88.67,46.25 82.7,46.25 82.32,45.87 82.32,45.11 81.56,44.34 79.02,44.34 78.51,44.85 78.51,46 78.13,46.38 75.72,46.38 74.58,45.23 74.58,39.9 74.83,39.65 84.48,39.65 84.74,39.39 84.74,38.88 85.24,38.38
  pour Top (isolate 0.254): 50.45,20.6 51.46,20.6 52.86,21.99 56.8,21.99 57.3,22.5 60.99,22.5 66.07,27.58 72.42,27.58 72.67,27.33 72.67,18.06 69.88,15.26 69.5,15.26 64.8,19.96 62.89,19.96 62.77,19.83 62.77,19.45 64.8,19.71 66.32,17.67 65.94,15.26 49.05,14.63 45.24,14.75 47.4,18.06 49.81,20.47
  pour Bottom (isolate 0.254): 54.64,15.13 54.76,14.12 54.89,13.23 54.64,13.23 54,12.6 50.19,12.6 49.81,12.98 49.81,13.48 49.56,13.74 47.27,13.74 46.51,12.98 46.51,11.45 46.38,11.33 43.84,11.33 43.21,11.96 43.21,14.25 43.46,14.5 44.35,14.5 45.87,16.02 45.87,16.66 46.26,17.04 46.26,18.18 47.53,19.45 47.78,19.45 48.54,20.21 48.8,20.21 49.56,20.98 51.72,20.98 51.97,20.72 51.97,18.56 52.22,18.31 52.61,18.31 53.88,17.04 53.88,15.64 54.26,15.64
  pour Top (isolate 0.254): 72.67,17.8 72.67,13.1 74.32,11.45 81.82,11.45 84.36,8.91 84.36,4.59 83.09,3.32 70.13,3.32 69.24,4.21 69.24,11.33 64.92,15.64 64.92,20.09 65.56,20.72 69.24,20.72 71.66,18.31
  pour Bottom (isolate 0.254): 77.37,11.96 76.48,11.96 76.1,11.58 76.1,5.23 78.89,2.43 87.66,2.43 88.42,3.2 88.42,5.36 89.05,5.99 90.2,5.99 90.83,6.63 90.83,10.69 90.32,11.2 88.04,11.2 87.78,10.94 87.78,10.56 88.29,10.05 88.29,9.93 88.04,9.67 83.72,9.67 82.58,10.82 82.58,11.07 81.82,11.83 77.5,11.83
  pour Top: 84.99,8.91 91.85,8.91 92.23,9.29 93.75,9.29 95.02,8.02 95.02,7.77 94.39,7.13 94.39,6.5 94.77,6.12 94.77,5.48 96.04,4.21 96.04,2.94 95.66,2.56 90.07,2.56 89.56,3.07 86.64,3.07 85.12,4.59 85.12,4.85 84.48,5.48
  pour Top (isolate 0.254): 49.18,39.27 45.49,39.27 44.86,38.63 44.86,37.36 44.35,36.85 35.84,36.85 32.79,31.77 34.19,31.01 34.06,22.88 43.72,22.88 48.67,28.98 49.43,29.36 49.56,31.01 49.56,38.88
  pour Top (isolate 0.254): 57.94,49.55 70.26,49.55 70.39,35.07 58.07,35.07
  pour Top: 66.7,28.85 71.27,28.85 71.27,47.39 67.59,47.39 67.59,39.01 65.94,39.01 65.94,28.85
  pour Bottom (isolate 0.254): 57.81,33.17 61.24,33.17 69.75,41.68 69.75,48.03 71.4,49.68 71.4,50.19 70.89,50.7 57.3,50.7 55.91,49.3 55.91,34.31 56.67,33.55
  pour Bottom (isolate 0.406): 0.03,51.46 27.46,51.46 28.22,50.7 28.22,48.03 27.21,47.01 27.21,45.23 26.19,44.22 26.19,44.09 25.43,43.33 25.43,37.99 27.71,35.71 30.13,35.71 30.76,36.34 30.76,36.85 31.27,37.36 34.95,37.36 35.46,36.85 35.46,34.95 34.44,33.93 34.44,31.39 33.94,30.88 28.6,30.88 27.46,29.74 27.46,24.53 26.7,23.77 24.67,23.77 24.03,24.41 24.03,26.44 25.3,27.71 25.3,32.03 23.65,33.68 20.6,33.68 17.17,30.25 17.17,25.17 15.9,23.9 0.54,23.9 0.15,24.41
IRD1
  Top 0.305: 55.91,2.56 55.27,1.93
  Top 0.406: J2.4 15.52,2.69 16.16,2.05 55.4,2.05 PIC1.19 55.91,2.56
IRD2
  Top 0.406: J2.5 12.98,1.61 13.3,1.29 PIC1.20
LED
  Top 0.305: 47.14,30.88 47.53,31.14 56.54,31.14
  Top 0.406: R22.2 47.14,30.88 | 56.54,31.14 PIC1.8
MEMCS
  Bottom 0.406: IC13.1 47.65,19.71 50.19,20.98 51.72,20.98 52.1,20.6 52.1,18.18 52.48,17.8 58.96,17.8 59.21,17.66
  Bottom 0.61: PIC1.29 71.53,21.61 71.27,21.99 71.27,22.88 70.26,23.9 68.35,23.9 67.97,23.52 67.97,19.96 67.59,19.45 65.43,19.45 64.67,18.69 64.67,18.06 63.91,17.29 59.58,17.29 59.21,17.66
MISO  (via drill 0.7)
  Top 0.406: PIC1.5 56.03,39.39 55.27,38.63 49.18,38.63 48.54,37.99 48.54,36.73 48.03,36.22 48.03,34.82 48.29,34.82 v48.29,35.01 | v41.3,41.3 38.76,41.3 38.76,38.12 39.08,37.8 R4.1
  Bottom 0.305: 45.11,21.61 45.11,18.44 45.75,17.8 45.75,17.17 | R17.1 38.13,41.3
  Bottom 0.406: 42.89,14.63 43.21,13.99 | v48.29,35.01 48.29,34.63 | 45.27,22.72 45.11,21.93 45.3,22.06 45.11,21.61 | 45.27,22.72 46.06,23.52 46.07,23.52 47.65,25.1 47.65,32.09 48.29,32.73 v48.29,35.01 | R6.2 45.43,22.56 45.27,22.72 | 45.75,17.17 45.75,16.15 44.22,14.63 42.89,14.63 | R5.1 42.89,14.63 | 43.53,39.65 44.29,38.88 44.29,37.8 44.79,37.3 45.49,37.3 48.37,34.42 47.99,34.93 v48.29,35.01 | R23.2 36.86,43.07 38.25,41.68 38.25,41.48 R17.1
  Bottom 0.61: 43.53,39.65 41.94,39.65 41.94,40.66 v41.3,41.3 R17.1
MOSI  (via drill 0.7)
  Top 0.305: 49.56,33.04 54.64,33.04 55.91,34.31
  Top 0.406: 55.91,34.31 PIC1.7 | v47.02,33.11 47.97,33.04 49.56,33.04
  Bottom 0.406: J1.7 40.03,10.82 40.67,11.45 40.67,15.9 41.1,15.69 IC13.5 43.84,15.9 44.48,16.53 44.48,20.34 43.84,20.98 43.84,22.88 45.11,24.15 45.11,31.77 | PIC1.7 55.91,34.31 55.27,34.95 55.27,43.07 54.51,43.84 50.19,43.84 48.29,45.74 U$3.1 | 45.11,31.77 IC8.17 | D4.C 42.57,37.49 43.53,36.53 45.11,36.53 47.02,34.63 v47.02,33.11 47.02,33.68 45.11,31.77
N$1  (via drill 0.7)
  Top 0.305: 36.22,20.98 35.27,21.93 33.36,21.93 33.05,21.61 32.73,21.61
  Top 0.406: U$1.5 19.29,28.17 19.08,27.96 19.08,24.79 22.25,21.61 32.73,21.61 | v54.26,26.06 53.49,26.06 52.73,25.29 47.21,25.29 42.89,20.98 36.22,20.98
  Bottom 0.406: R16.2 60.99,30.5 58.45,27.96 54.89,27.96 54.26,27.33 v54.26,26.06
N$2  (via drill 0.7)
  Top 0.406: v43.21,34.31 43.84,35.26 44.48,35.9 R4.2
  Bottom 0.406: IC8.19 v43.21,34.31
N$3
  Top 0.305: 22.73,23.04 22.89,22.88 | 33.05,22.56 32.73,22.25 28.92,22.25 28.6,22.56
  Top 0.406: U$1.1 21.41,25.63 20.35,25.42 22.73,23.04 23.2,22.56 28.6,22.56 | 50.32,26.5 50.32,26.82 | 50.32,26.5 R15.2 | 50.32,26.5 50.13,26.37 47.02,26.37 42.57,21.93 36.22,21.93 35.59,22.56 33.05,22.56
N$4
  Bottom 0.406: R5.2 J1.8
N$5
  Bottom 0.406: IC13.2 46.38,18.44 45.75,19.07 45.75,20.34 46.38,20.98 47.02,20.98 47.33,21.29 R6.1
N$6
  Bottom 0.305: IC7.10 32.46,39.41 32.29,39.58 | 36.35,41.68 32.86,41.68 32.1,40.92
  Bottom 0.406: R17.2 36.6,41.3 36.35,41.68 | 32.1,40.92 32.1,39.77 32.29,39.58
N$7
  Bottom 0.305: IC3.7 61.31,48.72 61.75,48.28 62.38,48.28 63.53,47.14 65.24,47.14 65.26,47.27 R11.1
  Bottom 0.406: R7.1 65.27,47.27 65.26,47.27
N$8
  Top 0.406: PIC1.1 66.7,49.55 67.59,48.66 67.59,39.01 65.69,37.11
  Top 0.61: R18.1 65.69,37.11
N$9
  Bottom 0.813: U$2.3 55.31,16.57 55.91,16.53 PIC1.14
N$10
  Bottom 0.813: U$2.1 55.95,20.3 PIC1.13
N$11
  Bottom 0.406: U$3.2 53.29,38.36 R43.2
  Bottom 1.016: U$3.2 U$3.3
N$12
  Bottom 0.305: IC4.1 39.74,5.65 39.02,6.37 38.89,6.37 38.76,6.5 38.64,6.5 38.51,6.63 36.1,6.63 35.71,6.25 35.71,4.59 J9.2
N$13
  pour Top (isolate 0.254): 94.77,52.09 97.18,52.09 97.18,43.07 96.8,42.69 95.15,42.69 94.64,43.2 94.64,52.09
  pour Bottom (isolate 0.254): 94.64,52.09 97.18,52.09 97.18,43.07 96.8,42.69 95.15,42.69 94.77,43.07 94.64,43.2
N$14
  Bottom 0.406: 3.58,21.23 IC2.4 4.28,21.83 C25.2
N$15
  Bottom 0.406: C26.2 4.66,14.56 4.22,14.12 3.69,14.12 IC9.4
N$16
  Bottom 0.305: IC7.13 31.11,37.46 31.02,35.2 | IC6.2 24.92,46.88 23.9,45.87
  Bottom 0.406: 31.02,35.2 28.22,32.41 27.56,32.41 IC15.6 25.94,32.53 23.14,34.95 | 23.14,34.95 23.14,36.54 C20.1 23.01,37.36 22.38,37.99 22.38,42.06 23.01,42.69 23.27,42.69 23.52,42.95 23.52,45.49 23.9,45.87 | 23.14,34.95 23.08,34.95 C30.2
N$17
  Bottom 0.305: IC4.8 43.42,5.52 J8.2
N$18
  Bottom 0.406: X1.14 88.29,15.64 88.04,15.9 74.58,15.9 73.94,15.26 71.27,15.26 69.88,16.66 R2.2 | R2.3 66.62,17.93 R2.2 | R2.2 R1.2
N$19
  Top 0.406: R22.1 45.11,29.87 44.48,29.23 40.54,29.23 39.52,28.22 36.1,28.22 35.46,28.85 35.46,32.28 36.22,33.04 J10.2
N$20  (via drill 0.7)
  Top 0.406: J7.2 41.94,45.74 42.57,45.11 45.11,45.11 45.75,45.74 45.75,48.28 46.38,48.92 50.19,48.92 50.83,48.28 50.83,45.11 51.34,44.6 54.13,44.6 54.64,45.11 54.64,46 55.02,46.38 55.02,47.52 55.78,48.28 63.65,48.28 v63.78,48.41
  Bottom 0.406: v63.78,48.41 63.78,49.42 63.65,49.55 62.01,49.55 IC3.8
N$22  (via drill 0.7)
  Top 0.406: R25.1 29.49,39.96 30.7,39.96 v30.95,39.71
  Bottom 0.305: 35.78,38.76 IC7.11 30.95,38.76 v30.95,39.71 | 35.27,33.23 35.27,33.61 35.46,33.8 35.71,33.8 36.1,34.06 36.48,34.44
  Bottom 0.406: D5.A 34.68,29.19 34.7,29.49 35.27,30.5 35.27,33.23 | 36.48,34.44 37.11,35.07 37.11,37.42 35.78,38.76
N$23
  Bottom 0.305: IC3.1 61.96,46.29 62.26,46 62.26,43.96 62,43.71
  Bottom 0.406: J7.3 40.92,48.28 41.3,47.9 41.3,47.14 41.43,47.01 41.43,46.25 42.57,45.11 45.11,45.11 45.75,45.74 45.75,48.28 46.38,48.92 50.19,48.92 50.83,48.28 50.83,45.11 51.34,44.6 54.76,44.6 56.16,43.2 61.5,43.2 62,43.71
N$24
  Bottom 1.422: 21.62,19.71 J5.1 | D1.A 21.62,19.71 | 21.62,19.71 Q2.C
  Bottom 1.676: J5.1 25.05,19.71 25.05,19.45
N$25
  Bottom 0.406: IC5.4 60.61,3.52 60.92,2.75 60.99,1.93 61.37,2.24 C27.2
N$26  (via drill 0.7)
  Top 0.406: R24.1 40.79,35.39 v39.52,34.63
  Bottom 0.305: IC7.9 36.7,40.06 37.24,39.52
  Bottom 0.406: v39.52,34.63 39.38,34.65 D4.A
  Bottom 0.61: 38.51,38.25 38.61,38.25
  Bottom 0.813: 37.24,39.52 38.51,38.25 | 38.61,38.25 D4.A
N$27
  Bottom 0.406: IC5.2 62.77,6.63 63.27,7.13 64.92,7.13 65.88,6.18 R36.1 R37.2
N$28
  Top 1.422: Q4.C 26.7,19.71 21.62,14.63 J4.1 12.2,15.9 D2.A
N$29
  Top 1.422: J4.3 12.83,19.71 D2.C
  Bottom 0.305: 13.36,19.71 12.09,18.44
  Bottom 0.61: R12.1 12.31,18.65 13.36,19.71
  Bottom 0.813: 13.36,19.71 J4.3
N$30  (via drill 0.7)
  Top 0.305: 29.24,27.96 33.17,27.96 v33.81,27.33
  Top 0.406: 27.12,29.44 27.76,29.44 29.24,27.96
  Top 0.61: 27.12,29.44 27.12,29.06
  Top 0.813: U$1.8 27.12,29.44
  Bottom 0.406: 36.86,27.33 J6.2
  Bottom 0.61: 33.68,27.33 v33.81,27.33 36.86,27.33
N$31  (via drill 0.7)
  Top 0.305: 25.3,37.74 25.3,34.57 29.3,30.44 32.86,30.44 | J18.2 31.65,26.25
  Top 0.406: 31.65,26.25 34.7,26.25 | 34.7,26.25 34.83,26.25 | v26.95,39.52 26.44,39.52 25.3,38.38 25.3,37.74 | 32.86,30.44 34.83,28.47 34.83,26.37 34.7,26.25
  Bottom 0.305: v26.95,39.52 28.09,38.12 28.11,38.11 IC7.3
N$32  (via drill 0.7)
  Top 0.406: J18.3 29.24,29.23 24.54,33.93 24.54,38.95 26.06,40.66 26.25,40.85 v27.08,40.98
  Bottom 0.254: 27.59,40.53 27.97,40.15 27.97,39.14 28.35,38.76
  Bottom 0.305: 28.35,38.76 IC7.4
  Bottom 0.406: v27.08,40.98 27.59,40.53
N$33
  Bottom 0.406: 55.27,1.93 55.27,2.31 55.53,2.56 58.45,2.56 59.53,1.48 59.53,1.61 | 59.53,1.61 C27.1 | 59.53,1.61 60.23,0.91 62.38,0.91 63.4,1.55 63.48,1.92 | 63.48,1.92 IC5.1 64.83,4.28 R36.2 | C23.1 63.49,1.93 63.48,1.92
  Bottom 0.813: J11.2 50.83,3.2 52.1,1.93 55.27,1.93
N$34
  Bottom 0.305: 26.7,44.41 26.7,44.33 IC6.4 | 25.81,38.63 26.06,38.5 26.95,38.5 27.71,37.61 27.97,37.49 28.87,37.49 IC7.2
  Bottom 0.406: 26.7,44.41 25.81,43.52 25.62,42.57 C22.1 R40.1 25.81,39.27 25.81,38.63
N$35
  Bottom 1.016: X1.17 95.91,11.9 C13.2 96.36,9.67 C14.2 94.64,9.55 93.37,8.28 93.37,6.39 L9.1
  Bottom 1.27: C28.+ 95.91,16.91 X1.17
N$37
  Bottom 0.406: X1.13 85.75,12.72 C8.2
N$38  (via drill 0.7)
  Top 0.406: IC14.6 92.74,8.91 v92.1,9.55
  Bottom 0.813: v92.1,9.55 90.2,11.45 87.65,11.45 | 87.65,11.45 C8.1 | R28.1 87.65,11.45
N$39
  Top 0.406: R27.1 96.04,4.17 R27.2 94.69,7.14 94.07,7.14 93.37,6.44 93.37,6.05 | C6.1 91.59,4.09 92.61,5.1 92.61,6.06 R29.1
  Top 0.61: 94.07,7.14 IC14.5 | R29.1 93.37,6.05
N$40
  Top 0.406: IC14.7 96.02,10.18 D3.A
N$41  (via drill 0.7)
  Top 0.406: D3.C 96.95,7.87 97.69,7.13 97.69,3.27 R27.3 97.31,2.06 96.55,1.29 94.13,1.29 93.25,2.18 | 93.25,2.18 v93.25,3.58 | C6.2 92.8,1.87 93.25,2.18
  Bottom 0.406: v93.25,3.58 R30.2
N$42
  Top 0.406: R33.1 82.71,1.75 R31.1
N$43  (via drill 0.7)
  Top 0.406: U$1.7 20.89,30.16 v21.74,31.01
  Bottom 0.406: L6.2 20.97,27.88 C16.2 | v21.74,31.01 21.74,29.04 C16.2 | C15.2 C16.2
  Bottom 1.27: C29.+ 21.94,24.53 C15.2
  pour Bottom (isolate 0.254): 18.82,26.95 19.08,26.95 20.86,25.29 22.25,25.29 22.51,25.55 22.51,29.99 23.14,30.63 23.14,31.9 22.89,32.15 20.98,32.15 18.32,29.49 18.32,27.83 18.44,27.45 18.57,27.2
N$44
  Top 0.406: R33.3 87.67,1.87 R32.2
N$45
  Top 0.406: IC14.3 84.8,8.91 84.8,5.92 R33.2
N$46
  Bottom 0.61: R3.1 69.56,13.29 67.46,15.39 R2.1
N$47  (via drill 0.7)
  Top 0.406: v77.69,7.83 77.75,7.9 78.01,7.9 80.04,10.05 81.05,10.05 | 81.05,10.05 81.05,9.93 | 81.05,10.05 81.05,10.94 81.69,11.58 84.04,11.58 R34.1
  Bottom 0.406: v77.69,7.83 77.69,5.04 79.02,3.51 82.43,3.51 Q1.1
N$48
  Top 0.406: R34.2 IC14.1
N$49  (via drill 0.7)
  Top 0.406: IC14.2 87.66,10.18 87.02,9.86 83.21,9.86 v82.32,9.93
  Bottom 1.016: R35.2 82.77,10.12 C10.2 82.7,10.05 v82.32,9.93
N$50  (via drill 0.7)
  Top 0.305: 54.37,23.9 54,23.52 | 54.37,23.9 57.05,26.69 | 47.97,23.52 53.99,23.52 | 53.99,23.52 54.32,23.85 | 53.99,23.52 54.37,23.9
  Top 0.406: 57.05,26.69 PIC1.10 | 32.41,14.63 32.41,16.53 33.36,17.48 35.9,17.48 37.62,19.2 43.65,19.2 47.97,23.52
  Top 0.61: J12.2 20.98,11.45 22.25,11.45 23.84,13.04 v30.19,13.04 30.82,13.04 32.41,14.63
  Bottom 1.016: R20.1 29.24,12.85 v30.19,13.04
N$69  (via drill 0.7)
  Top 0.305: v26.44,37.49 25.94,36.73 25.94,35.07 29.36,31.52 29.87,31.01 32.41,31.01 33.05,31.64 33.05,34.12 | R38.1 35.02,36.41 35.02,36.16 | 33.11,33.93 R39.2
  Top 0.406: 35.02,36.16 35.02,36.09 33.05,34.12 33.05,33.99 33.11,33.93
  Bottom 0.305: IC7.1 27.89,36.81 27.59,36.98 27.21,37.23 27.08,37.36 26.95,37.36 v26.44,37.49
N$78  (via drill 0.7)
  Top 0.406: v49.56,37.49 50.19,37.49 50.32,37.34 Q3.1
  Bottom 0.61: v49.56,37.49 R43.1
N$80  (via drill 0.7)
  Top 0.406: PIC1.6 55.91,36.85 54.51,35.45 54,35.2 51.57,35.2 Q3.2 50.68,35.2 49.43,35.2 v49.43,35.96
  Bottom 0.406: 47.78,38.63 R44.2 48.41,38.06 48.41,36.34 48.8,35.96 v49.43,35.96
PHONEMISO
  Bottom 0.406: 59.84,46.89 IC3.4 57.43,44.47 PIC1.3
PHONEMOSI
  Bottom 0.406: IC3.5 59.55,49.51 59.08,49.04 59.08,48.66 58.19,47.77 57.94,47.77 PIC1.2
PHONEPWR
  Bottom 0.406: 58.19,11.45 59.59,11.45 IC5.5
  Bottom 0.61: PIC1.16 58.19,11.45
PYRO1  (via drill 0.7)
  Top 0.406: 34.04,16.25 Q4.B 34.04,16.21 35.9,16.21 37.81,18.12 44.16,18.12 48.61,22.88 61.62,22.88 v64.8,26.06
  Bottom 0.406: PIC1.34 68.61,34.31 R10.2 68.29,33.8 67.97,33.68 67.34,33.04 67.34,29.87 66.7,29.23 66.07,29.23 64.8,27.96 v64.8,26.06
PYRO2  (via drill 0.7)
  Top 0.305: 43.21,20.02 37.18,20.02 v35.9,19.07
  Top 0.406: v53.81,24.79 53.3,24.34 47.53,24.34 43.21,20.02
  Bottom 0.406: v53.81,24.79 55.27,24.79 55.91,25.42 59.72,25.42 | v35.9,19.07 35.57,20.34 Q2.B | 66.7,25.42 67.02,25.42
  Bottom 0.813: PIC1.30 72.04,24.15 70.77,25.42 67.02,25.42 R9.2 | 66.7,25.42 66.32,25.42 65.69,24.79 60.35,24.79 59.72,25.42
RFGND
  pour Bottom (isolate 0.254): 94.01,52.09 90.58,52.09 90.58,46.76 89.82,46 89.82,40.92 90.58,40.15 99.34,40.15 100.36,41.17 100.36,52.09 97.82,52.09 97.82,42.95 96.93,42.06 94.77,42.06 94.01,42.82
  pour Top (isolate 0.254): 94.01,52.09 94.01,42.82 94.77,42.06 96.93,42.06 97.94,43.07 97.94,43.2 97.82,43.33 97.82,52.09 100.36,52.09 100.36,41.17 99.34,40.15 90.58,40.15 89.82,40.92 89.82,46 90.58,46.76 90.58,52.09
RSSI
  Top 0.406: X1.11 80.67,15.26 78.13,17.8 77.5,17.8 75.97,19.33 75.97,30.76 74.96,31.77 PIC1.33
  Bottom 1.016: R35.1 X1.11
RTCCS
  Bottom 0.406: IC8.1 53.37,35.58 55.91,33.04 60.35,33.04 69.88,42.57 69.88,46.38 70.51,47.01 PIC1.39
RXA
  Top 0.406: U$1.3 22.04,26.9 22.51,26.44 22.51,25.17 24.16,23.52 28.92,23.52 29.55,22.88 32.41,22.88 33.05,23.52 35.59,23.52 36.22,22.88 42.25,22.88 46.7,27.33 48.54,27.33 49.05,27.83 53.88,27.83 55.27,29.23 PIC1.9 58.45,29.23 59.72,30.5 R14.1
RXB  (via drill 0.7)
  Top 0.406: 27.97,26.69 29.24,25.42 39.4,25.42 39.91,25.93 39.91,27.58 40.6,28.28 44.67,28.28 45.75,29.36 48.03,29.36 49.18,30.5 53.94,30.5 v54.45,30.12 54.38,30.12
  Top 0.61: U$1.6 26.49,28.17 27.97,26.69
  Bottom 0.406: PIC1.37 70.51,41.93 59.08,30.5 54.32,30.5 v54.45,30.12 | 74.89,40.92 R13.1
  Bottom 0.813: PIC1.37 73.05,41.93 73.94,40.92 74.89,40.92
RXD
  Bottom 0.406: 76.23,5.17 78.83,2.56 87.66,2.56 87.49,2.73 87.02,2.73 | 87.02,2.73 Q1.3 | 87.02,2.73 87.66,3.37 C9.2 89.95,3.52 R30.1
  Bottom 0.813: 76.23,5.17 76.23,12.09 74.32,13.99 PIC1.26
RXSEL
  Bottom 0.406: X1.16 93.37,14.63 90.83,17.17 76.23,17.17 74.32,19.07 PIC1.28
TAOS1  (via drill 0.7)
  Top 0.305: v50.19,18.06 47.59,17.8 45.24,15.45 35.97,15.45 35.14,14.63 33.68,14.63 29.87,10.82
  Top 0.406: J1.3 29.87,10.82
  Bottom 0.406: v50.19,18.06 51.08,17.8 51.46,17.42 51.46,16.66 52.48,15.64 52.48,15.52 52.73,15.26 58.96,15.26 60.48,13.74 60.61,13.87 66.45,13.87 67.85,12.47 67.85,11.07 70,8.91 71.78,8.91
  Bottom 0.61: 71.78,8.91 PIC1.24
TAOS2
  Top 0.305: 32.41,12.09 33.68,13.36 34.95,13.36 36.22,14.63 48.8,14.63 49.56,15.39 51.59,15.39 51.72,15.52 | 69.5,9.29 69.62,9.42 69.62,11.45 69.5,11.58
  Top 0.406: J1.4 32.41,12.09 | PIC1.22 72.16,4.09 69.62,4.09 69.5,4.34 69.5,9.29 | 51.72,15.52 51.97,15.26 65.81,15.26 69.5,11.58
TAOS3
  Top 0.406: J1.5 34.95,12.21 36.22,13.48 49.18,13.48 50.07,14.37 51.97,14.37 52.22,14.12 57.05,14.12 PIC1.15
TXA  (via drill 0.7)
  Top 0.406: R15.1 55.27,27.33 55.91,27.96 v60.35,27.96
  Bottom 0.406: PIC1.35 69.12,36.85 66.07,33.8 66.07,30.5 63.53,27.96 v60.35,27.96
TXB
  Bottom 0.406: PIC1.36 70.13,39.39 64.48,33.74 R16.1
TXD
  Bottom 0.61: PIC1.25 69.81,11.45 R3.2
TXSEL
  Bottom 0.305: 72.54,16.53 89.56,16.53 90.83,15.26
  Bottom 0.406: 90.83,15.26 X1.15 | PIC1.27 72.54,16.53

## Text on the board
tNames: - | -
_tsilk: PHONE | TEMP | ADC | 1 | - | LED | 2 | - | RTC | BATT | + | - | APEX | - | V 2.1 | NIM2 | PYRO | + | LIGHT | Vbatt | I2C | - | - | 3V | - | + | + | HUM | + | - | - | - | IRD | CAM | 40X2 3V3 | SQL | 6V | D1 | D0 | 5V | - | 3V | 5V | 3V | - | C2 | - | D2 | - | Vreg | GAIN
_bsilk: M. BREJZA | 5/10 | MAIN BOARD | CNTR | SHFT